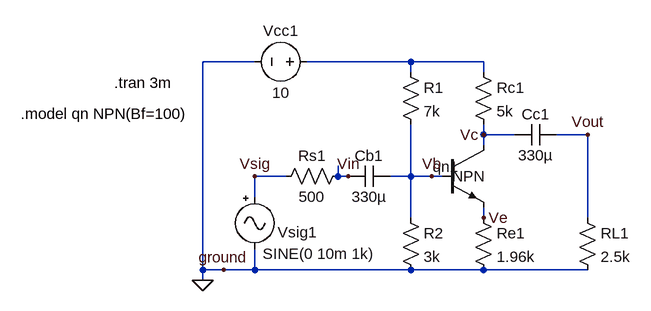
[diagram p0: schematic Draft4.asc]
Draft4.asc, the LTspice schematic file:
Version 4
SHEET 1 936 680
WIRE 352 208 272 208
WIRE 592 208 432 208
WIRE 704 208 592 208
WIRE 592 224 592 208
WIRE 704 224 704 208
WIRE 704 320 704 304
WIRE 752 320 704 320
WIRE 864 320 816 320
WIRE 704 336 704 320
WIRE 400 384 352 384
WIRE 480 384 480 368
WIRE 496 384 480 384
WIRE 592 384 592 304
WIRE 592 384 560 384
WIRE 624 384 592 384
WIRE 640 384 624 384
WIRE 352 416 352 384
WIRE 592 448 592 384
WIRE 704 448 704 432
WIRE 864 448 864 320
WIRE 272 528 272 208
WIRE 304 528 272 528
WIRE 352 528 352 496
WIRE 352 528 304 528
WIRE 592 528 352 528
WIRE 704 528 592 528
WIRE 864 528 704 528
WIRE 272 544 272 528
FLAG 304 528 ground
FLAG 272 544 0
FLAG 704 448 Ve
FLAG 624 384 Vb
FLAG 864 320 Vout
FLAG 496 384 Vin
FLAG 352 384 Vsig
FLAG 704 320 Vc
SYMBOL voltage 448 208 R90
WINDOW 0 -32 56 VBottom 2
WINDOW 3 32 56 VTop 2
SYMATTR InstName Vcc1
SYMATTR Value 10
SYMBOL res 688 208 R0
SYMATTR InstName Rc1
SYMATTR Value 5k
SYMBOL res 576 208 R0
SYMATTR InstName R1
SYMATTR Value 7k
SYMBOL cap 816 304 R90
WINDOW 0 0 32 VBottom 2
WINDOW 3 32 32 VTop 2
SYMATTR InstName Cc1
SYMATTR Value 330µ
SYMBOL cap 560 368 R90
WINDOW 0 0 32 VBottom 2
WINDOW 3 32 32 VTop 2
SYMATTR InstName Cb1
SYMATTR Value 330µ
SYMBOL res 384 400 R270
WINDOW 0 32 56 VTop 2
WINDOW 3 0 56 VBottom 2
SYMATTR InstName Rs1
SYMATTR Value 500
SYMBOL res 576 432 R0
SYMATTR InstName R2
SYMATTR Value 3k
SYMBOL res 688 432 R0
SYMATTR InstName Re1
SYMATTR Value 1.96k
SYMBOL res 848 432 R0
SYMATTR InstName RL1
SYMATTR Value 2.5k
SYMBOL npn 640 336 R0
WINDOW 0 -14 33 Left 2
WINDOW 3 16 48 Left 2
SYMATTR InstName qn1
SYMBOL signal 352 400 R0
WINDOW 0 35 70 Left 2
WINDOW 3 12 103 Left 2
WINDOW 123 0 0 Left 2
WINDOW 39 0 0 Left 2
SYMATTR InstName Vsig1
SYMATTR Value SINE(0 10m 1k)
TEXT -8 288 Left 2 !.model qn NPN(Bf=100)
TEXT 136 240 Left 2 !.tran 3m

The netlist it stands for:
* Draft4.asc
Vcc1 N001 0 10
Rc1 N001 Vc 5k
R1 N001 Vb 7k
Cc1 Vout Vc 330µ
Cb1 Vb Vin 330µ
Rs1 Vsig Vin 500
R2 Vb 0 3k
Re1 Ve 0 1.96k
RL1 Vout 0 2.5k
qn1 Vc Vb Ve 0 NPN
Vsig1 Vsig 0 SINE(0 10m 1k)
.model NPN NPN
.model PNP PNP
.lib standard.bjt
.model qn NPN(Bf=100)
.tran 3m
.backanno
.end